# Altium schematic sheet STM32ComputeModuleSch.SchDoc
size A
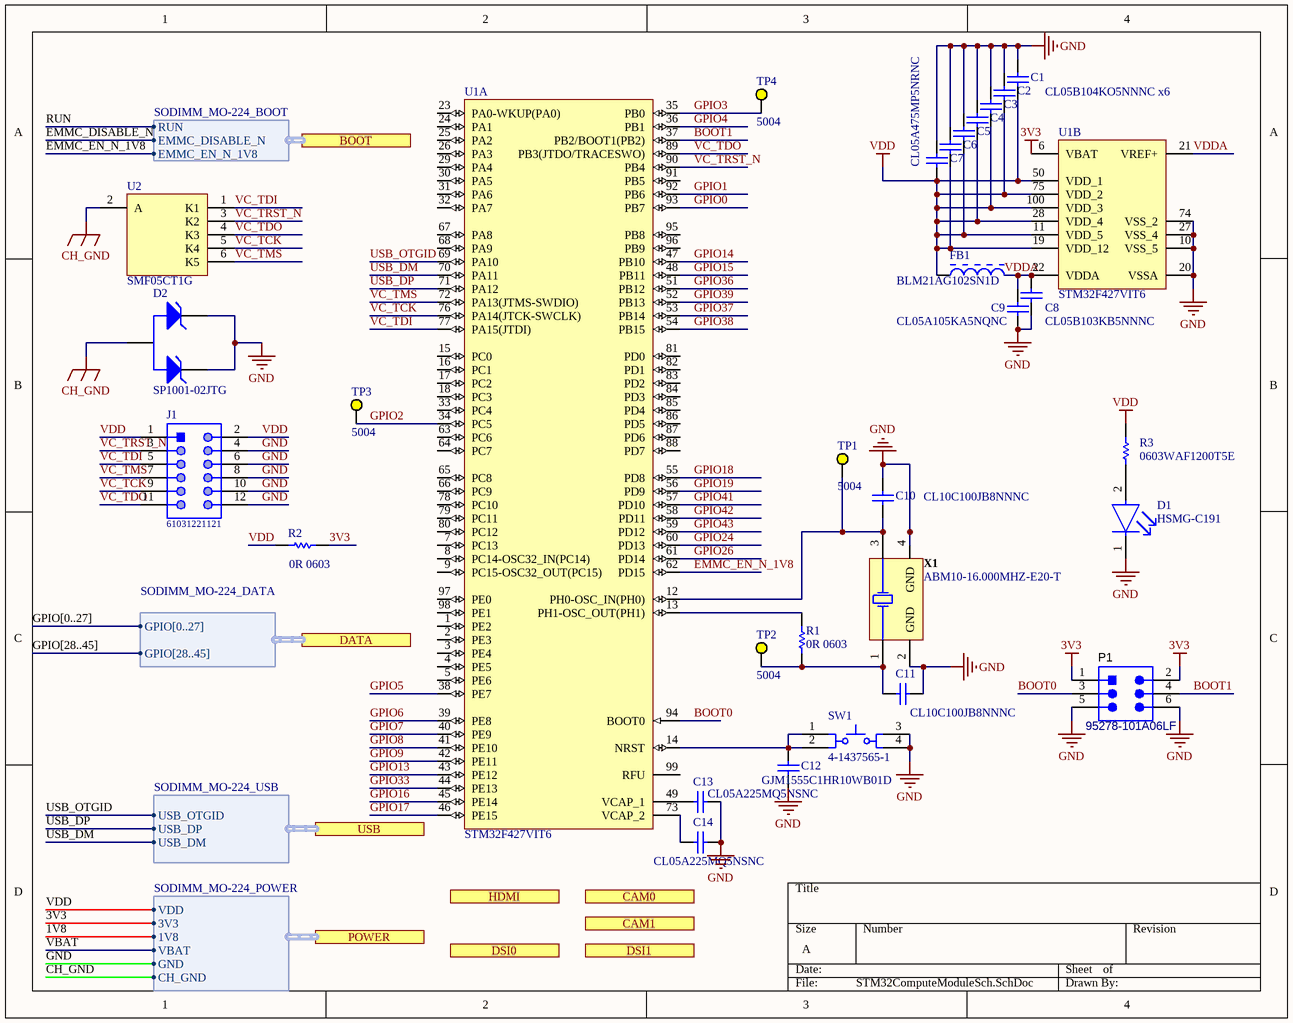
[diagram p0: STM32ComputeModuleSch.SchDoc]

## Parts
C1  CL05B104KO5NNNC x6  [CAPC1005X55X25NL05T10]  (value not drawn)
C2  CL05B104KO5NNNC x6  [CAPC1005X55X25NL05T10]  (value not drawn)
C3  CL05B104KO5NNNC x6  [CAPC1005X55X25NL05T10]  (value not drawn)
C4  CL05B104KO5NNNC x6  [CAPC1005X55X25NL05T10]  (value not drawn)
C5  CL05B104KO5NNNC x6  [CAPC1005X55X25NL05T10]  (value not drawn)
C6  CL05B104KO5NNNC x6  [CAPC1005X55X25NL05T10]
C7  CL05A475MP5NRNC  [CAPC1005X55X25NL05T10]
C8  CL05B103KB5NNNC  [CAPC1005X55X25NL05T10]
C9  CL05A105KA5NQNC  [CAPC1005X55X25NL05T10]
C10  CL10C100JB8NNNC  [CAPC1608X90X35ML10T15]
C11  CL10C100JB8NNNC  [CAPC1608X90X35ML10T15]
C12  GJM1555C1HR10WB01D  [CAPC1005X55X25NL05T10]
C13  CL05A225MQ5NSNC  [CAPC1005X55X25NL05T10]
C14  CL05A225MQ5NSNC  [CAPC1005X55X25NL05T10]
D1  HSMG-C191  [FP-HSMG-C191-MFG]
D2  SP1001-02JTG  [LFUS-SC70-3_V]
FB1  BLM21AG102SN1D  [MURA-BLM21-H1-CHIP-2_V]
J1  61031221121  [61031221121]
P1  95278-101A06LF  [AMPM-95278-101A06LF_V]
R1  0R 0603  [RESC1609X55X30ML10T20]
R2  0R 0603  [RESC1609X55X30ML10T20]
R3  0603WAF1200T5E  [RESC1609X50X30LL8T20]
SW1  4-1437565-1  [TECO-4-1437565-1_V]
TP1  5004  [KSTN-5004]
TP2  5004  [KSTN-5004]
TP3  5004  [KSTN-5004]
TP4  5004  [KSTN-5004]
U1  STM32F427VIT6  [STM-LQFP100_V]  (parts A,B of 2)
U2  SMF05CT1G  [ONSC-SC70-6-419B-02_W_V]
X1  ABM10-16.000MHZ-E20-T  [ABRA-ABM10_V]

## Ports
BOOT (harness SODIMM_MO-224_BOOT), CAM0 (harness SODIMM_MO-224_CAM0), CAM1 (harness SODIMM_MO-224_CAM1), DATA (harness SODIMM_MO-224_DATA), DSI0 (harness SODIMM_MO-224_DSI0), DSI1 (harness SODIMM_MO-224_DSI1), HDMI (harness SODIMM_MO-224_HDMI), POWER (harness SODIMM_MO-224_POWER), USB (harness SODIMM_MO-224_USB)

## Harnesses
SODIMM_MO-224_POWER: VDD, 3V3, 1V8, VBAT, GND, CH_GND
SODIMM_MO-224_USB: USB_OTGID, USB_DP, USB_DM
SODIMM_MO-224_DATA: GPIO[0..27], GPIO[28..45]
SODIMM_MO-224_BOOT: RUN, EMMC_DISABLE_N, EMMC_EN_N_1V8

## Nets
3V3: P1.1 P1.2 R2.2 U1.6(VBAT) ; port POWER.3V3
CH_GND: D2.3(A) U2.2(A) ; port POWER.CH_GND
GND: C1.2 C2.2 C3.2 C4.2 C5.2 C6.2 C7.2 C8.1 C9.1 C10.2 C11.1 C12.1 C13.1 C14.1 D1.1(C) D2.1(K) D2.2(K) J1.4 J1.6 J1.8 J1.10 J1.12 P1.5 P1.6 SW1.3 SW1.4 U1.10(VSS_5) U1.20(VSSA) U1.27(VSS_4) U1.74(VSS_2) X1.2(GND) X1.4(GND) ; port POWER.GND
VDD: C1.1 C2.1 C3.1 C4.1 C5.1 C6.1 C7.1 FB1.1 J1.1 J1.2 R2.1 R3.1 U1.11(VDD_5) U1.19(VDD_12) U1.28(VDD_4) U1.50(VDD_1) U1.75(VDD_2) U1.100(VDD_3) ; port POWER.VDD
1V8: port POWER.1V8
BOOT0: P1.3 U1.94(BOOT0)
BOOT1: P1.4 U1.37(PB2/BOOT1(PB2))
EMMC_DISABLE_N: port BOOT.EMMC_DISABLE_N
EMMC_EN_N_1V8: U1.62(PD15) ; port BOOT.EMMC_EN_N_1V8
GPIO0: U1.93(PB7)
GPIO1: U1.92(PB6)
GPIO2: TP3.1 U1.34(PC5)
GPIO3: TP4.1 U1.35(PB0)
GPIO4: U1.36(PB1)
GPIO5: U1.38(PE7)
GPIO6: U1.39(PE8)
GPIO7: U1.40(PE9)
GPIO8: U1.41(PE10)
GPIO9: U1.42(PE11)
GPIO13: U1.43(PE12)
GPIO14: U1.47(PB10)
GPIO15: U1.48(PB11)
GPIO16: U1.45(PE14)
GPIO17: U1.46(PE15)
GPIO18: U1.55(PD8)
GPIO19: U1.56(PD9)
GPIO24: U1.60(PD13)
GPIO26: U1.61(PD14)
GPIO33: U1.44(PE13)
GPIO36: U1.51(PB12)
GPIO37: U1.53(PB14)
GPIO38: U1.54(PB15)
GPIO39: U1.52(PB13)
GPIO41: U1.57(PD10)
GPIO42: U1.58(PD11)
GPIO43: U1.59(PD12)
RUN: port BOOT.RUN
USB_DM: U1.70(PA11) ; port USB.USB_DM
USB_DP: U1.71(PA12) ; port USB.USB_DP
USB_OTGID: U1.69(PA10) ; port USB.USB_OTGID
VBAT: port POWER.VBAT
VC_TCK: J1.9 U1.76(PA14(JTCK-SWCLK)) U2.5(K4)
VC_TDI: J1.5 U1.77(PA15(JTDI)) U2.1(K1)
VC_TDO: J1.11 U1.89(PB3(JTDO/TRACESWO)) U2.4(K3)
VC_TMS: J1.7 U1.72(PA13(JTMS-SWDIO)) U2.6(K5)
VC_TRST_N: J1.3 U1.90(PB4) U2.3(K2)
VDDA: C8.2 C9.2 FB1.2 U1.21(VREF+) U1.22(VDDA)
NetC10_1: C10.1 TP1.1 U1.12(PH0-OSC_IN(PH0)) X1.3(X2)
NetC11_2: C11.2 R1.2 TP2.1 X1.1(X1)
NetC12_2: C12.2 SW1.1 SW1.2 U1.14(NRST)
NetC13_2: C13.2 U1.49(VCAP_1)
NetC14_2: C14.2 U1.73(VCAP_2)
NetD1_2: D1.2(A) R3.2
NetR1_1: R1.1 U1.13(PH1-OSC_OUT(PH1))

Not connected (* = marked no-connect by the designer): U1 1(PE2) 2(PE3) 3(PE4) 4(PE5) 5(PE6) 7(PC13) 8(PC14-OSC32_IN(PC14)) 9(PC15-OSC32_OUT(PC15)) 15(PC0) 16(PC1) 17(PC2) 18(PC3) 23(PA0-WKUP(PA0)) 24(PA1) 25(PA2) 26(PA3) 29(PA4) 30(PA5) 31(PA6) 32(PA7) 33(PC4) 63(PC6) 64(PC7) 65(PC8) 66(PC9) 67(PA8) 68(PA9) 78(PC10) 79(PC11) 80(PC12) 81(PD0) 82(PD1) 83(PD2) 84(PD3) 85(PD4) 86(PD5) 87(PD6) 88(PD7) 91(PB5) 95(PB8) 96(PB9) 97(PE0) 98(PE1) 99(RFU)

## Buses and harness runs
bus GPIO[0..27]
bus GPIO[28..45]

## Library data of the parts
C1-C9 C13 C14 = CMP-2008-04549-1: Manufacturer: SAMSUNG ELECTRO
  C1-C6: Part Number: CL05B104KO5NNNC
  C7: Part Number: CL05A475MP5NRNC
  C8: Part Number: CL05B103KB5NNNC
  C9: Part Number: CL05A105KA5NQNC
  C13 C14: Part Number: CL05A225MQ5NSNC
C10 C11 = CMP-2000-04945-1: Chip Capacitor, 22 pF, +/- 5%, 50 V, -55 to 125 degC, 0603 (1608 Metric), RoHS, Tape and Reel; Manufacturer: Murata; Capacitance: 22pF; Rated Voltage: 50V; Dielectric: C0G; Manufacturer URL: http://www.murata.com/; Datasheet Version: Jul-06; Package Reference: 603; Tolerance (%): ±5%; Case Size/Dimension: 0603; Package Description: 2-Pin Surface Mount Device, Body 1.6 x 0.8 mm; Datasheet URL: https://datasheet.ciiva.com/11786/0900766b807a1cab-11786398.pdf
C12 = CMP-2008-04549-1: Manufacturer: Murata; Part Number: GJM1555C1HR10WB01D
D1 = CMP-18399-000001-1: LED GREEN DIFFUSED CHIP SMD; Manufacturer: Broadcom; Viewing Angle: 170°; Max Junction Temp: +95°C; Wavelength: 572nm; Peak Emmision Wavelength: 570nm; Led Orientation: Top View; Luminous Intensity: 15mcd; Reverse Voltage: 5V; Forward Current: 20mA; Forward Voltage: 2.2V; Power Dissipation: 52mW; Ipc Land Pattern Name: DIOC16080X45; Digikey Description: LED GREEN DIFFUSED CHIP SMD; Temperature Range High: +85°C; Height: 0.7mm; Automotive: No; Footprint 0 Description: SM LED; 2 Flat Leads; Device Class L3: unset; ComponentLink2Description: Datasheet; Lead Free: Yes; Package: 0; Mouser Description: LED Uni-Color Green 570nm 2-Pin Chip LED T/R; RoHS: TRUE; Category: Diode; Manufacturer Part Number: HSMG-C191; Device Class L1: Optoelectronics; Temperature Range Low: -40°C; Device Class L2: LEDs; Colour: Green; Octopart: https://octopart.com/hsmg-c191-broadcom-71131308; Temperature: -40°C to +85°C; ComponentLink2URL: https://docs.broadcom.com/docs/AV02-0551EN
D2 = CMP-2000-07134-1: TVS Diode Array, 0.7 to 1.2 V, -40 to 125 degC, 3-Pin SOT23 (SC70), RoHS, Tape and Reel; Manufacturer: Littelfuse; No of Channels: 2; Capacitance: 8pF; Directional: Uni-Directional; Clamping Voltage-Max: 13V; Manufacturer URL: http://www.littelfuse.com/; Datasheet URL: http://www.littelfuse.com/~/media/electronics/datasheets/tvs_diode_arrays/littelfuse_tvs_diode_array_sp1001_datasheet.pdf.pdf; Package Reference: SC70-3; Datasheet Version: 01/2016; Mounting Technology: SurfaceMount; Package Description: 3-Pin Small Outline Transistor, Body 2.05 x 1.25 mm, Pitch 0.65 mm; Operating Temp Range: -40to+85°C
FB1 = CMP-0686-00665-2: Chip Ferrite Bead for General Signal lines, 1000 Ohm, 500 mA, -55 to 125 degC, 2 x 1.25 x 1.05 mm SMD, Tape and Reel; Manufacturer: Murata; Impedance (at 100 MHz): 1000 Ohm +/- 25%; DC Resistance: 0.28 Ohm Max.; Rated Current: 500 mA; ComponentLink1Description: Manufacturer URL; PackageDescription: 2-Pin Chip, Body 2 x 1.25 mm; DatasheetVersion: 08/2013; PartNumber: BLM21AG102SN1D; Mounting Technology: Surface Mount; Operating Temperature Range: -55 to 125 degC; ComponentLink2URL: http://www.murata.com/products/catalog/pdf/c31e.pdf; ComponentLink3Description: Package Specification; ComponentLink2Description: Datasheet; Packing: Tape and Reel; ComponentLink3URL: http://www.murata.com/products/catalog/pdf/c31e.pdf; ComponentLink1URL: http://www.murata.com/; PackageReference: BLM21_H1050-2
J1 = CMP-1502-01054-1: SMT Vertical Pin Header WR-PHD, Pitch 2.54 mm, Dual Row, 12 pins; Manufacturer: Wurth Elektronik; Pin Number: 12; Pitch: 2.54mm; Gender: Male; Withstanding Voltage: 500VAC; Working Voltage: 250VAC; Rated Current: 3A; Contact Resistance: 20mOhm; Row Number: Dual; Publisher: WurthElektronik; Mounting Technology: SMT; Packaging: TapeandReel; Part Number: 61031221121; Orientation: Vertical; Operating Temperature: -40to125degC; Manufacturer URL: http://www.we-online.de; Package Reference: 61031221121; Datasheet URL: https://katalog.we-online.de/em/datasheet/6103xx21121.pdf
P1 = CMP-1743-00002-1: Male Header, Pitch 2.54 mm, 2 x 3 Position, Height 14.4 mm, RoHS, Tape and Reel; Power Rating: 100 mW; Tolerance: 1%; Resistance: 49.9 Ohm; Case\Package: 0603; Voltage Rating: 50 V; DatasheetVersion: Rev. AC, 03/2016; PackageDescription: Male Header, Pitch 2.54 mm, 2 x 3 Position, Height 14.4 mm; REACH SVHC: No SVHC; Height: 0.45 mm; Mount: Surface Mount; Case Code (Imperial): 0603; Max Operating Temperature: 155 degC; Case Code (Metric): 1608; Packaging: Tape and Reel; RoHSCompliant: true; ComponentLink1Description: Datasheet; Min Operating Temperature: -55 degC; Length: 1.6 mm; Width: 0.8 mm; ComponentLink1URL: http://portal.fciconnect.com/Comergent//fci/drawing/95278.pdf; PackageReference: 95278-101A06LF
R1 R2 = CMP-2000-03816-1: Part Number: CRCW06030000Z0EA; Manufacturer: Vishay Dale
R3 = CMP-1666-00020-2: Chip Resistor, 120 Ohm, +/- 1%, 100 mW, -55 to 155 degC, 0603 (1608 Metric), RoHS, Tape and Reel; Forward Current: 10 mA; Nominal Wavelength: 466 nm; Case\Package: 0603; Forward Voltage: 3.9 V; Luminous Intensity: 5 mcd; Illumination Colour: Blue; Power Rating: 68 mW; Lens Style: Diffused; Viewing Angle: 160 degrees; Colour: Blue; Case Code (Imperial): 0603; Max Operating Temperature: 100 degC; REACH SVHC: No SVHC; Width: 0.8 mm; ComponentLink2Description: Datasheet; ComponentLink1URL: http://www.vishay.com/; Radiation Hardening: No; PackageReference: 0603; Package Quantity: 3000; Pins: 2; Mount: Surface Mount; ComponentLink1Description: Manufacturer URL; Case Code (Metric): 1608; Length: 1.6 mm; RoHSCompliant: true; Packaging: Tape and Reel; Min Operating Temperature: -40 degC; ComponentLink2URL: http://www.farnell.com/datasheets/1533075.pdf; Height: 0.6 mm; PackageDescription: 2-Pin Surface Mount Device, Body 1.575 x 0.85 mm; Nominal Vf: 3.9 V; DatasheetVersion: Nov-10
SW1 = CMP-2000-05602-1: Tactile Switch, 50 mA, 12 VDC, -20 to 85 degC, 4-Pin SMD, RoHS, Bulk; Manufacturer: TEConnectivity/AMPBrand; Illumination Type: N/R; Maximum Contact Resistance: 100mOhm; Actuator Style: RoundButton; Actuator Length: 1.4mm; Contact Rating @ Voltage: 0.05@12VDCA; Maximum DC Voltage Rating: 12V; Body Orientation: Straight; Ground Terminal: No; Dielectric Strength: 500VAC; Operating Force: 1.57N; Electrical Life: 100000Cycle; Mechanical Life: N/A; Family: FSMJSMA; Contact Material: CopperAlloy; Type: N/A; RoHS: Yes; Pole Throw Configuration: N/A; Operating Temperature: -20to85C; Minimum Insulation Resistance: 100MOhm; Package Description: 4-Pin Surface Mount Device, Body 6 x 6 mm, Pitch 9.1 mm; Housing Material: N/A; Switch Configuration: N/A; Mounting: SurfaceMount,GullWing; Datasheet URL: https://datasheet.ciiva.com/14635/0900766b80912216-14635826.pdf; Packaging: Bulk; Base Material: N/A; Actuator Color: N/A; Dimension: 6x10x5.25mm; Contact Plating: Silver; Seal Location: N/A; Mounting Technology: SurfaceMount; Part No: 4-1437565-1; Seal Description: N/A; Maximum AC Voltage Rating: N/A; Datasheet Version: 04/2007; Manufacturer URL: http://www.te.com/; Package Reference: 4-1437565-1; Product Weight: N/A
TP1-TP4 = CMP-2000-05575-1: Test Point, Yellow, 1-Pin THD, RoHS, Bulk; Manufacturer: Keystone; Package Description: 1-Pin Through Hole Device, Dia 2.54 mm; Manufacturer URL: http://www.keyelco.com/; Datasheet Version: Rev. G, 12/2008; Package Reference: 5004; Datasheet URL: http://www.keyelco.com/product-pdf.cfm?p=1313; Mounting Technology: ThroughHole
U1 = CMP-0237-00070-3: ARM Cortex-M3 32-bit MCU, 512 KB Flash, 128 KB Internal RAM, 82 I/Os, 100-pin LQFP, -40 to 85 degC, Tray; PartNumber: STM32F207VET6; I/Os (High Current): 82; FLASH Size (Prog) (kB): 512; Internal RAM Size (kB): 128; D/A Converter: 2x12-bit (2 Channel); Supply Voltage(Vcc) min (V): 1.8; Operating Frequency(F) (Processor speed) (MHz): 120; Packing: Tray; PackageVersion: Rev. 1, 06/2013; ComponentLink2URL: http://www.st.com/st-web-ui/static/active/en/resource/technical/document/datasheet/CD00237391.pdf; ComponentLink3URL: http://www.st.com/st-web-ui/static/active/en/resource/technical/document/data_brief/DM00071938.pdf; Mounting Technology: Surface Mount; Core: ARM Cortex-M3; PackageReference: LQFP100; DatasheetVersion: Rev. 9; ComponentLink1URL: http://www.st.com/web/en/home.html; ComponentLink2Description: Datasheet; ComponentLink3Description: Package Specification; ComponentLink1Description: Manufacturer URL; PackageDescription: 100-Pin Low Profile Quad Flat Package, 14 x 14 mm Body, 0.5 mm Pitch
U2 = CMP-1061-00155-1: 5-Line Transient Voltage Suppressor Array, 6-Pin SC70, Pb-Free, Tape and Reel; Manufacturer: On Semiconductor; PPK Max (W): 100; Direction: Unidirectional; IR Max (uA): 5; PackageDescription: 6-Pin Small Outline Transistor, Body 2 x 1.25 mm, Pitch 0.65 mm; PackageReference: SC70-6-419B-02_W; ComponentLink2Description: Datasheet; Mounting Technology: Surface Mount; Packing: Tape and Reel; DatasheetVersion: Rev. 4; ComponentLink1Description: Manufacturer URL; ComponentLink2URL: http://www.onsemi.com/pub_link/Collateral/SMF05C-D.PDF; ComponentLink3Description: Package Specification; ComponentLink1URL: http://www.onsemi.com/; ComponentLink3URL: http://www.onsemi.com/pub_link/Collateral/SMF05C-D.PDF; PackageVersion: Rev. W; PartNumber: SMF05CT1G; RoHS: Pb-Free
X1 = CMP-2000-05727-1: Ceramic SMD Ultra Miniature Quartz Crystal, 25 MHz, 100 Ohm, 10 pF, -40 to 85 degC, 4-Pin SMD, RoHS, Tape and Reel; Manufacturer: ABRACON; Case Width: 2mm; Case Length: 2.5mm; Frequency: 25MHz; ESR: 100Ohms; Load Capacitance: 10pF; Case Height: 0.5mm; Tolerance: 20PPM; Frequency Stability: 30PPM; Manufacturer URL: http://www.abracon.com/; Datasheet URL: https://datasheet.ciiva.com/4946/abm10-31166-4946144.pdf; Type: UltraMiniatureQuartzCrystal; Series: ABM10; Mounting Style: SMD/SMT; Operating Temperature Range: -40Cto+85C; Mounting Technology: SurfaceMount; Factory Pack Quantity: 3000; Datasheet Version: 01/2013; Packaging: Reel; Brand: ABRACON; Package Description: 4-Pin Surface Mount Device, Body 2 x 2.5 mm, Pitch 1.65 mm; Termination Style: SMD/SMT; Product Category: Crystals; Package / Case: 2.5mmx2mmx0.5mm; Dimensions: 2mmWx2.5mmLx0.5mmH; RoHS: Details; Package Reference: ABM10